# EAGLE design TinyGame RC1_JTAG (EAGLE 6.5.0)
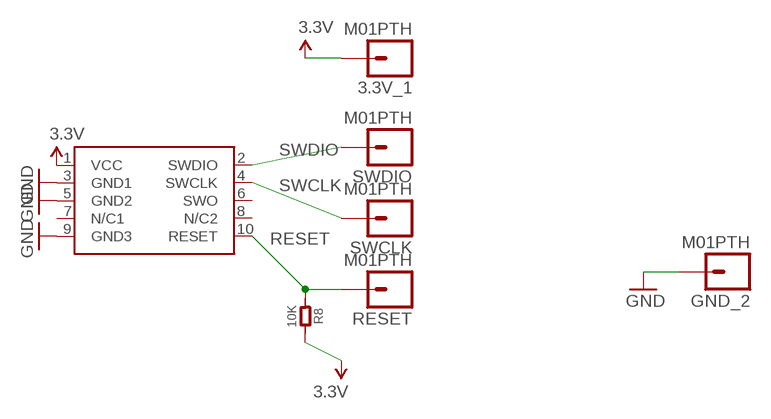
[diagram p0: schematic, sheet 1]

## Parts
3.3V_1  M01PTH  [1X01]
GND_2  M01PTH  [1X01]
R8  10K  R-0603  [R0603]
RESET  M01PTH  [1X01]
SWCLK  M01PTH  [1X01]
SWD1  CORTEX_SWDVERT  [SWD_VERTICAL]
SWDIO  M01PTH  [1X01]

## Nets
3.3V: 3.3V_1.1 R8.2 SWD1.1(VCC)
GND [GND]: GND_2.1 SWD1.3(GND1) SWD1.5(GND2) SWD1.9(GND3)
RESET: R8.1 RESET.1 SWD1.10(RESET)
SWCLK: SWCLK.1 SWD1.4(SWCLK)
SWDIO: SWD1.2(SWDIO) SWDIO.1
Unconnected: SWD1.6(SWO) SWD1.7(N/C1) SWD1.8(N/C2)

## Library data of the parts
3.3V_1 GND_2 RESET SWCLK SWDIO = SparkFun-Connectors:M01: Header 1 Standard 1-pin 0.1" header. Use with straight break away headers (SKU : PRT-00116), right angle break away headers (PRT-00553), swiss pins (PRT-00743), machine pins (PRT-00117), and female headers (PRT-00115).
R8 = OPL:R*
SWD1 = carrilib with jtags:CORTEX_SWD: .05" Cortex M Connector in SWD mode Manufacturer: Generic Part Number: Cortex M SWD Notes: I use Harwin M50-3600542 connectors

## Net classes
0 default: clearance 0.178 mm
1 GND: width 0.203 mm, drill 0.203 mm, clearance 0.203 mm

## Board
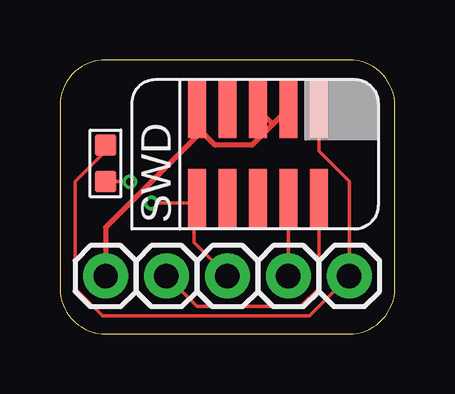
[diagram p1: board, top side]
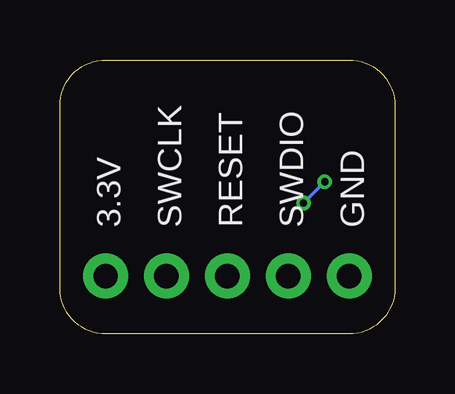
[diagram p2: board, bottom side, seen from below]

Size 13.97 x 11.43 mm. Coordinates in mm from the lower left corner, seen from the top.
Outline: 12.07,11.43 1.9,11.43 arc90 0,9.53 0,1.91 arc90 1.9,0 12.07,0 arc90 13.97,1.91 13.97,9.53 arc90 12.07,11.43
Copper layers (1*16): Top 0.035mm / dielectric 1.5mm / Bottom 0.035mm
Design rules "ITEADstudio_DRC *": minimum track width 6mil, minimum drill 12mil, track to track 6mil, track to pad 6mil, pad to pad 6mil, via to via 6mil, smd to smd 0mil, copper to edge 13mil, drill to drill 10mil, minimum pad ring 10mil, minimum via ring 6mil, stop-mask expansion 2mil, vias tented up to drill 100mil, thermal gap 10mil

### Footprints (pad centres in the part's own frame; a part is rotated, then mirrored left to right if it is on the bottom)
1X01 = drill 1.016 pad 1.88: 1 0,0
R0603 = smd 0.889 x 0.889: 1 -0.762,0; 2 0.762,0
SWD_VERTICAL = smd 0.75 x 2.5: 1 -2.54,-1.81; 2 -2.54,2; 3 -1.27,-1.81; 4 -1.27,2; 5 0,-1.81; 6 0,2; 7 1.27,-1.81; 8 1.27,2; 9 2.54,-1.81; 10 2.54,2

### Placement (x,y rotation side)
3.3V_1  12.07,2.41 0 top
GND_2  1.9,2.41 0 top
R8  1.9,7.11 90 top
RESET  6.99,2.41 0 top
SWCLK  9.53,2.41 0 top
SWD1  8.26,7.62 180 top
SWDIO  4.45,2.41 0 top

### Tracks (layer width: path | path; a pad name or v marks a point on that pad's centre or on a via)
3.3V
  Top 0.152: R8.2 1.9,7.62 0.64,6.35 0.64,1.91 1.78,0.76 10.41,0.76 3.3V_1.1 12.07,6.35 10.79,7.62 SWD1.1
GND
  Top 0.203: 8.89,8.76 9.53,9.4 SWD1.3 | 8.89,8.76 8,7.87 6.48,7.87 5.71,8.64 SWD1.9 5.84,8.38 1.9,4.45 GND_2.1 | 8.89,8.76 8.26,9.4 SWD1.5
RESET  (via drill 0.3)
  Top 0.152: v2.92,6.35 R8.1 | 5.59,5.46 v3.81,5.46 | 5.59,5.46 5.71,5.59 SWD1.10 5.59,5.46 | RESET.1 5.59,3.81 5.59,5.46
  Bottom 0.152: v3.81,5.46 v2.92,6.35
SWCLK
  Top 0.152: SWCLK.1 SWD1.4
SWDIO
  Top 0.152: SWD1.2 10.79,1.91 10.03,1.14 5.71,1.14 SWDIO.1

### Text on the board
bPlace: GND | 3.3V